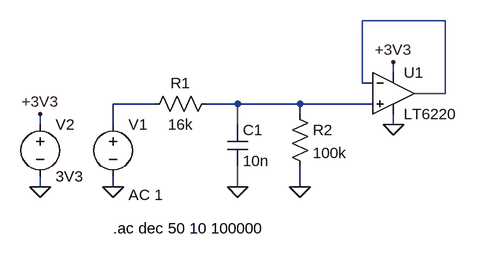
[diagram p0: schematic lpf_0_2.asc]
lpf_0_2.asc, the LTspice schematic file:
Version 4
SHEET 1 880 680
WIRE 512 -48 384 -48
WIRE 432 32 432 16
WIRE 384 48 384 -48
WIRE 400 48 384 48
WIRE 512 64 512 -48
WIRE 512 64 464 64
WIRE 64 80 0 80
WIRE 192 80 144 80
WIRE 288 80 192 80
WIRE 400 80 288 80
WIRE 288 96 288 80
WIRE -112 112 -112 96
WIRE 0 112 0 80
WIRE 192 112 192 80
WIRE 432 112 432 96
WIRE -112 208 -112 192
WIRE 0 208 0 192
WIRE 192 208 192 176
WIRE 288 208 288 176
FLAG 192 208 0
FLAG 0 208 0
FLAG 288 208 0
FLAG 432 16 +3V3
FLAG 432 112 0
FLAG -112 208 0
FLAG -112 96 +3V3
SYMBOL res 160 64 R90
WINDOW 0 0 56 VBottom 2
WINDOW 3 32 56 VTop 2
SYMATTR InstName R1
SYMATTR Value 16k
SYMBOL cap 176 112 R0
SYMATTR InstName C1
SYMATTR Value 10n
SYMBOL voltage 0 96 R0
WINDOW 123 24 124 Left 2
WINDOW 39 0 0 Left 2
SYMATTR Value2 AC 1
SYMATTR InstName V1
SYMATTR Value ""
SYMBOL res 272 80 R0
SYMATTR InstName R2
SYMATTR Value 100k
SYMBOL Opamps\\LT6220 432 64 R0
SYMATTR InstName U1
SYMBOL voltage -112 96 R0
WINDOW 123 0 0 Left 2
WINDOW 39 0 0 Left 2
SYMATTR InstName V2
SYMATTR Value 3V3
TEXT 0 272 Left 2 !.ac dec 50 10 100000

The netlist it stands for:
* lpf_0_2.asc
R1 N003 N002 16k
C1 N003 0 10n
V1 N002 0 AC 1
R2 N003 0 100k
XU1 N003 N001 +3V3 0 N001 LT6220  ; pins In+ In- V+ V- OUT
V2 +3V3 0 3V3
.ac dec 50 10 100000
.lib LTC4.lib
.backanno
.end